# EasyEDA Pro project ProProject_Access Control AC Power Switch_2024-06-06.epro, board V2.0.1 Power Relay PCB
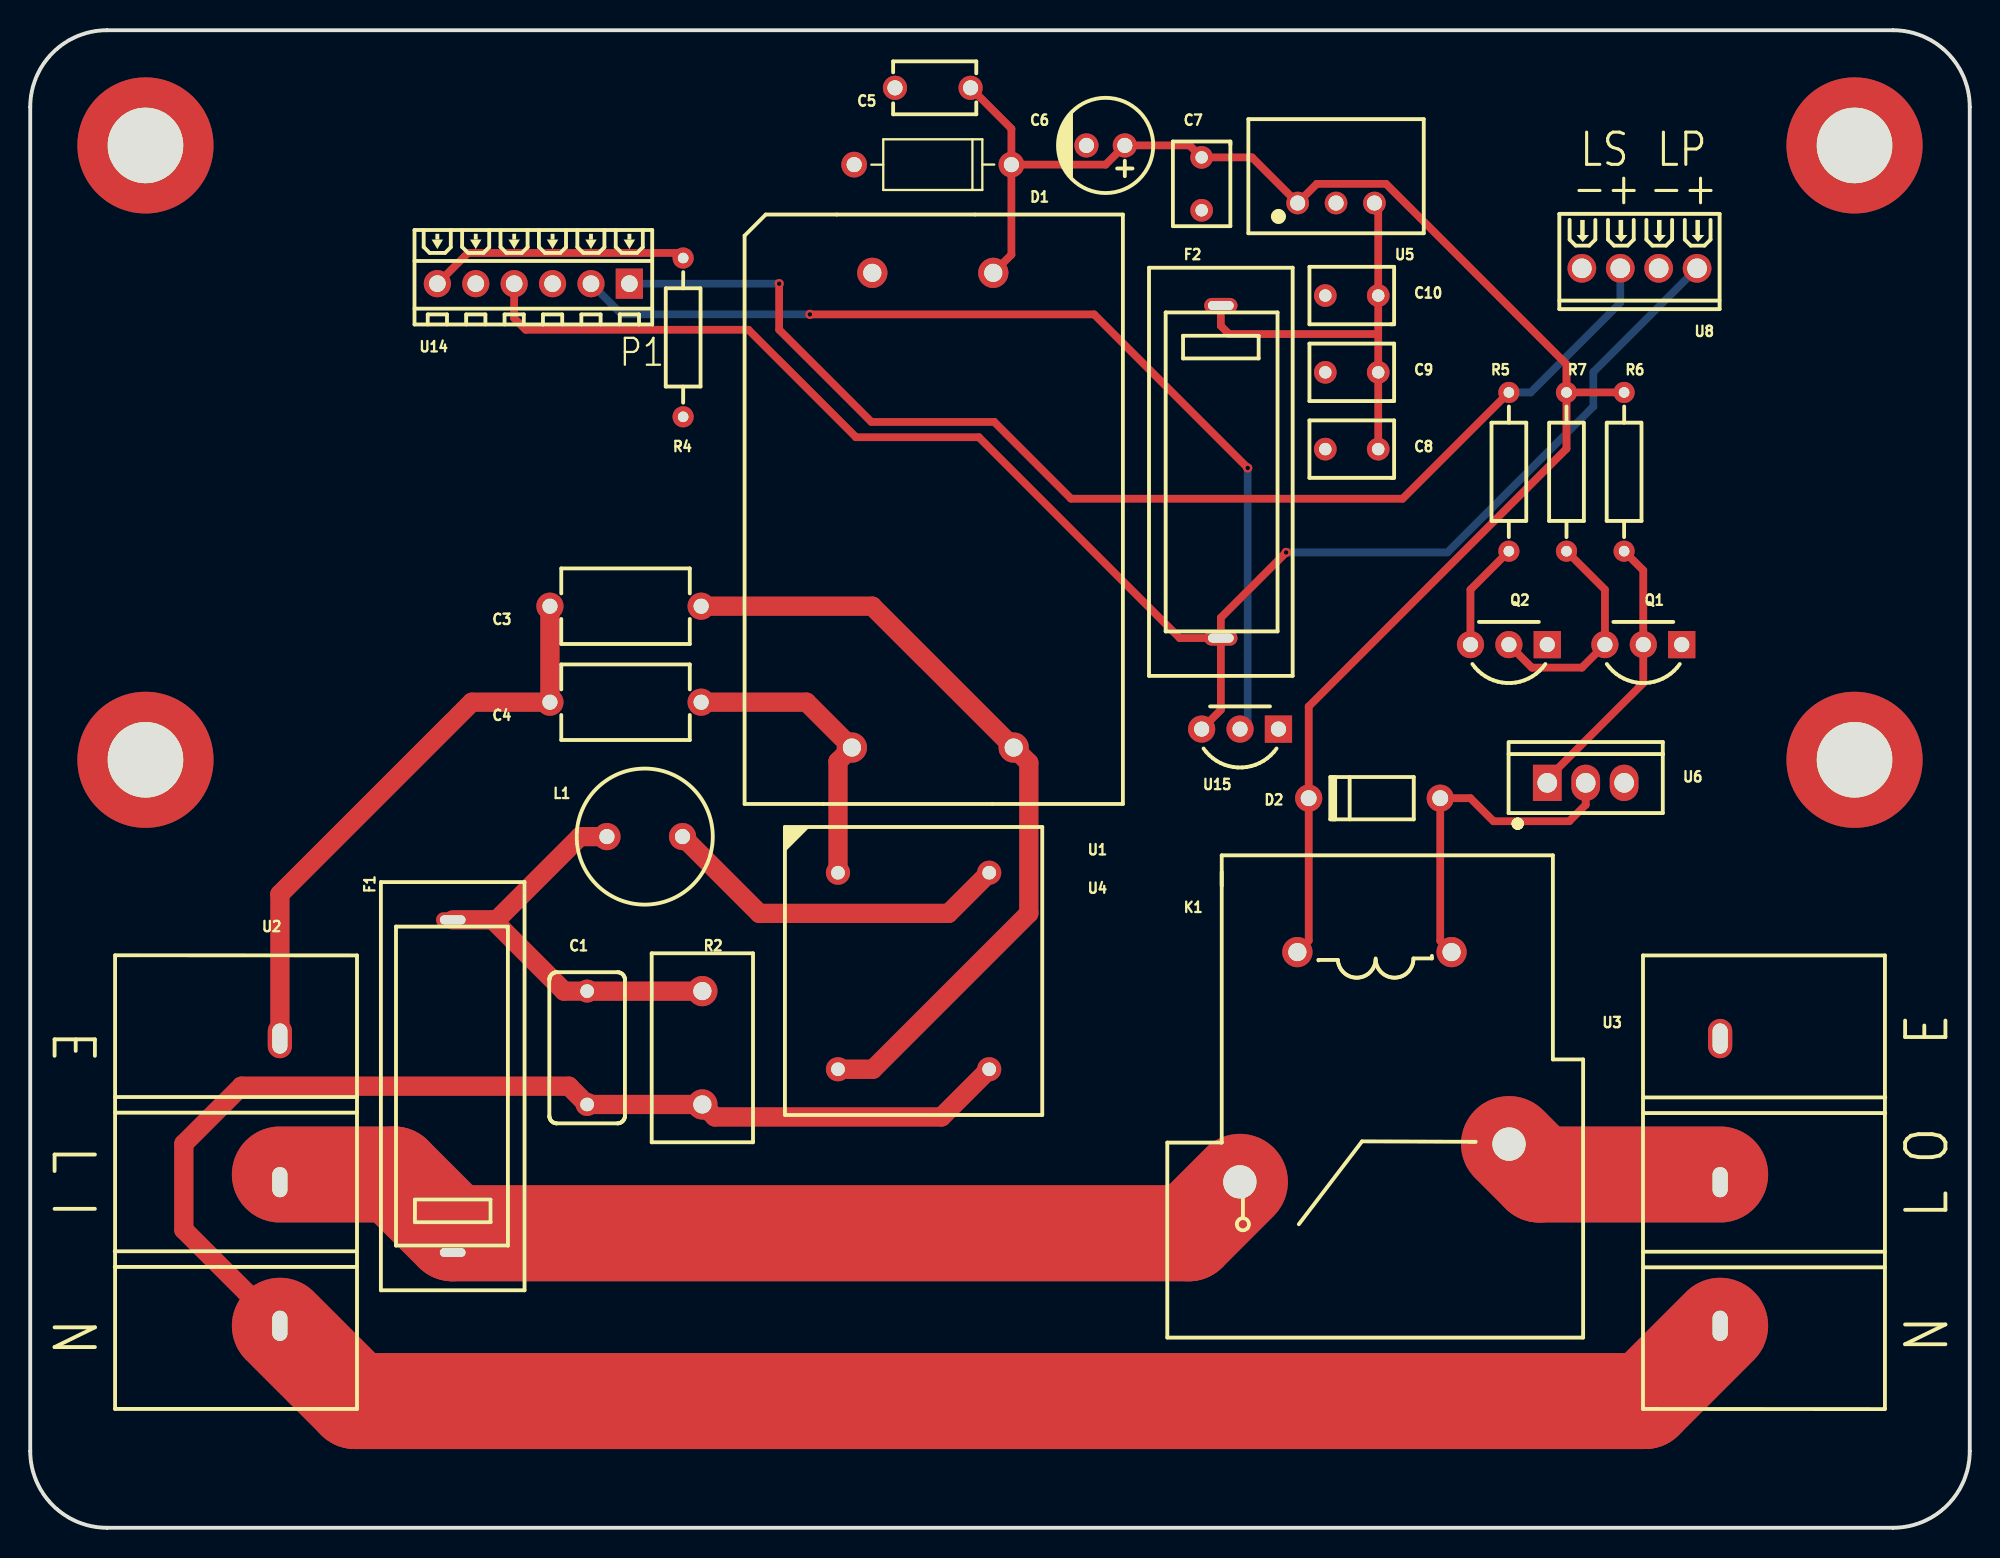
[diagram p7: board, top side]
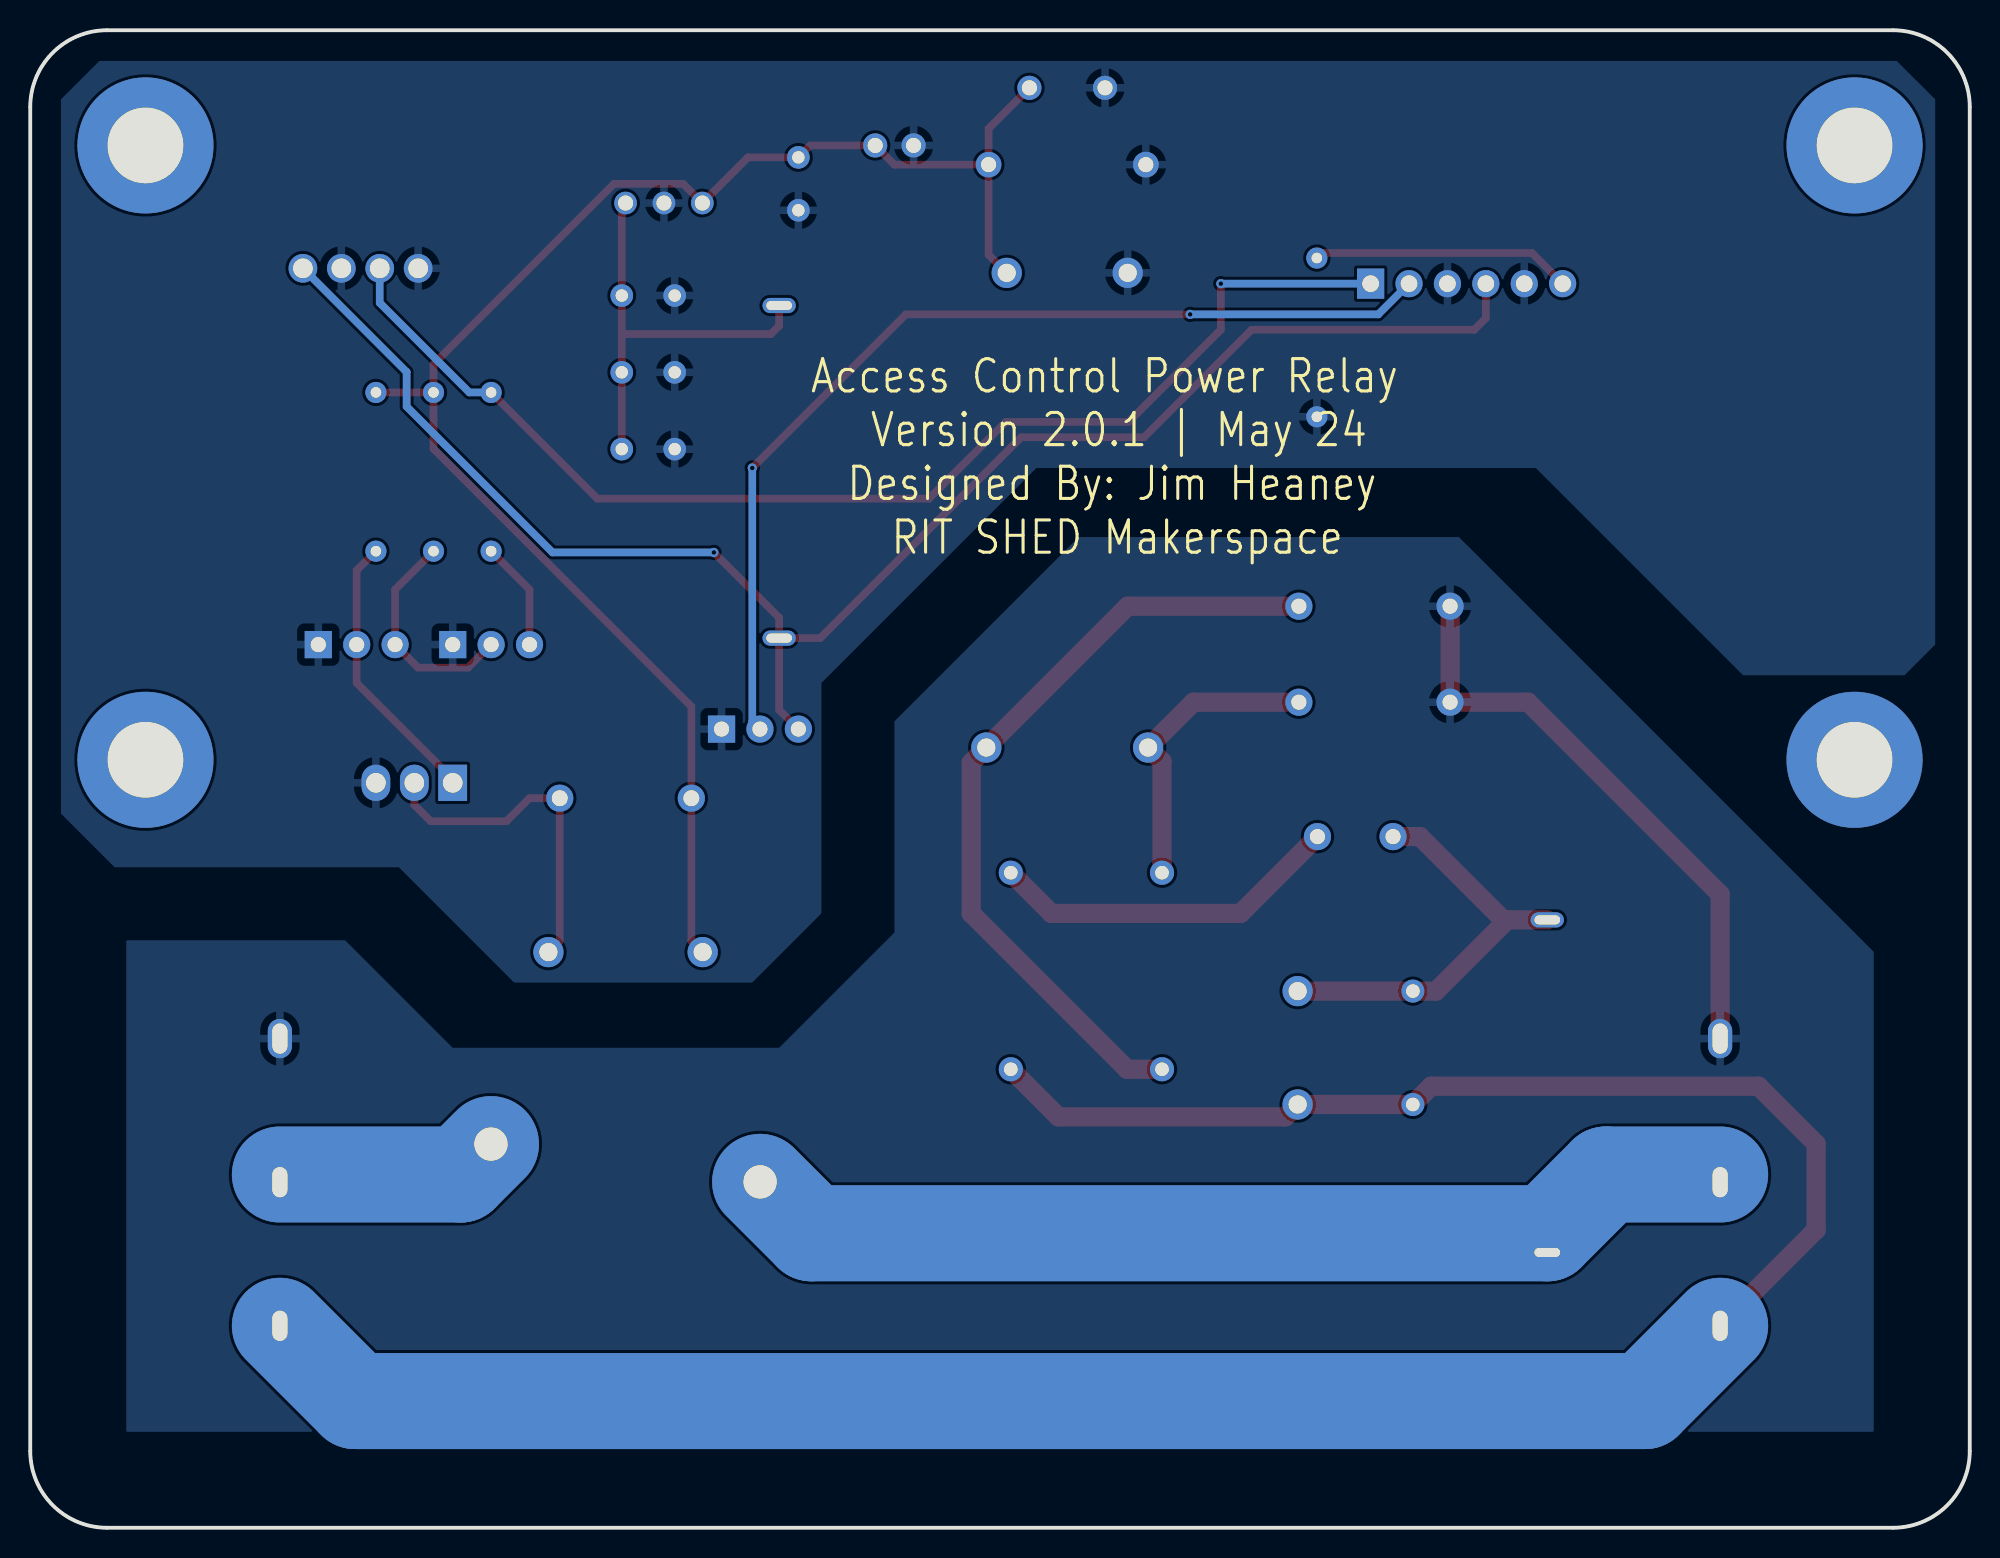
[diagram p8: board, bottom side, seen from below]

Outline 128.27 x 99.06 mm; copper layers: Top Layer, Bottom Layer. Coordinates in mm from the lower left corner of the outline.
Outline path: 0,93.98 0,5.08 arc(1.49,1.49) 5.08,0 123.19,0 arc(126.78,1.49) 128.27,5.08 128.27,93.98 arc(126.78,97.57) 123.19,99.06 5.08,99.06 arc(1.49,97.57) 0,93.98
Stack: Top Layer 0.035mm / Dielectric1 1.51mm FR4 er 4.5 / Bottom Layer 0.035mm

## Design rules (mm)
template: Custom Config
spacing copperThickness1oz (default): track to track 0.102, other pairs 0.152 to 0.3
spacing copperThickness2oz: track to track 0.203, other pairs 0.152 to 0.3
track width copperThickness1oz (default): min 0.127, default 0.254, max 50.8
track width copperThickness2oz: min 0.203, default 0.254, max 2.54
differential pair differentialPair (default): width min 0.127, default 0.254, max 2.54; gap min 0.152, default 0.152
via viaSize (default): diameter min 0.5, default 0.61, max 10; hole min 0.3, default 0.305, max 6.299
pour e695 uses copperRegion1

## Placement (name value [footprint] x y rotation side)
C1  100nF  [CAP-TH_L10.0-W5.0-P7.50-D0.6]  36.83 31.75 270 top
C3  1nF  [CAP-TH_L8.5-W5.0-P10.00-D0.6]  39.37 60.96 0 top
C4  1nF  [CAP-TH_L8.5-W5.0-P10.00-D0.6]  39.37 54.61 180 top
C5  1uF  [CAP-TH_L5.5-W3.5-P5.00-D1.2]  59.69 95.25 0 top
C6  220uF  [CAP-TH_BD6.3-P2.50-D1.0-FD]  71.12 91.44 180 top
C7  10uF  [CAP-TH_L5.5-W3.8-P3.50-D0.6]  77.47 88.9 270 top
C8  10uF  [CAP-TH_L5.5-W3.8-P3.50-D0.6]  87.4 71.35 180 top
C9  10uF  [CAP-TH_L5.5-W3.8-P3.50-D0.6]  87.4 76.43 180 top
C10  10uF  [CAP-TH_L5.5-W3.8-P3.50-D0.6]  87.4 81.51 180 top
D1  P6KE15A  [DO-15_BD3.2-L6.4-P10.40-D0.8-RD]  59.69 90.17 180 top
D2  1N4007  [DO-41_BD2.4-L4.7-P8.70-D0.8-RD]  88.9 48.26 0 top
F1  5x20 BLX-A型 保险丝支架 XC-7  [FUSE-TH_L22.6-W9.0]  27.94 29.21 90 top
F2  5x20 BLX-A型 保险丝支架 XC-7  [FUSE-TH_L22.6-W9.0]  78.74 69.85 270 top
K1  NB90E-12S-S-A  [RELAY-TH_NB90E-XXS-S-A]  88.9 30.48 180 top
L1  560uH  [IND-TH_BD9.0-P5.00-D0.7]  40.64 45.72 0 top
NOREF  -  [Pad_e847]  7.62 50.8 0 top
NOREF#2  -  [Pad_e844]  7.62 91.44 0 top
NOREF#3  -  [Pad_e848]  120.65 50.8 0 top
NOREF#4  -  [Pad_e846]  120.65 91.44 0 top
Q1  2SC1815L-GR-T92-B  [TO-92-3_L4.9-W3.7-P2.54-L]  106.68 58.42 180 top
Q2  2SC1815L-GR-T92-B  [TO-92-3_L4.9-W3.7-P2.54-L]  97.79 58.42 180 top
R2  10D471K  [RES-TH_L12.5-W6.7-P7.50-D1.2]  44.45 31.75 270 top
R4  5.1kΩ  [RES-TH_BD2.3-L6.5-P10.50-D0.5]  43.18 78.74 90 top
R5  5.1kΩ  [RES-TH_BD2.3-L6.5-P10.50-D0.5]  97.79 69.85 270 top
R6  5.1kΩ  [RES-TH_BD2.3-L6.5-P10.50-D0.5]  105.41 69.85 90 top
R7  5.1kΩ  [RES-TH_BD2.3-L6.5-P10.50-D0.5]  101.6 69.85 90 top
U1  TAS10-12-W2  [PWRM-TH_TAS10-XX-W2]  59.69 67.31 90 top
U2  DBT50G-9.5-3P  [CONN-TH_3P-P9.50_DBT50G-9.5-3P]  16.51 22.86 270 top
U3  DBT50G-9.5-3P  [CONN-TH_3P-P9.50_DBT50G-9.5-3P]  111.76 22.86 90 top
U4  YDUU10.5-253L0321  [IND-TH_4P-L19.0-W17.0]  58.42 36.83 270 top
U5  K7805-1000R3  [PWRM-TH_YLPTEC_K78XX-1000R3]  86.36 87.63 0 top
U6  WGP30N10V  [TO-220-3_L10.0-W4.6-P2.54-L]  102.87 49.28 0 top
U8  MX128-2.54-04P-GN01-Cu-Y-A  [CONN-TH_4P-P2.54_MX128-2.54-GN01-04P-CU-Y-A]  106.43 83.31 180 top
U14  MX128-2.54-06P-GN01-Cu-Y-A  [CONN-TH_6P-P2.54_MX128-2.54-6P]  33.27 82.3 180 top
U15  DS18B20+T&R  [TO-92-3_L4.9-W3.7-P2.54-L]  80.01 52.83 180 top

## Footprints (pads in the part's own frame, mm; a bottom-side part is the same pattern mirrored in y, then rotated)
CAP-TH_BD6.3-P2.50-D1.0-FD
  round 1.6 hole 1: 1(-1.27,0) 2(1.27,0)
CAP-TH_L5.5-W3.5-P5.00-D1.2
  round 1.6 hole 1: 1(-2.5,0) 2(2.5,0)
CAP-TH_L5.5-W3.8-P3.50-D0.6
  round 1.5 hole 0.82: 1(-1.75,0) 2(1.75,0)
CAP-TH_L8.5-W5.0-P10.00-D0.6
  round 1.8 hole 1: 1(-5,0) 2(5,0)
CAP-TH_L10.0-W5.0-P7.50-D0.6
  round 1.524 hole 0.9: 1(-3.75,0) 2(3.75,0)
CONN-TH_3P-P9.50_DBT50G-9.5-3P
  oval 2.6x1.6 hole 2x1: 1(-9.5,0) 2(0,0) 3(9.5,0)
CONN-TH_4P-P2.54_MX128-2.54-GN01-04P-CU-Y-A
  round 1.9 hole 1.3: 1(-3.81,0) 2(-1.27,0) 3(1.27,0) 4(3.81,0)
CONN-TH_6P-P2.54_MX128-2.54-6P
  rect 1.8x2 hole 1.1: 1(-6.35,0)
  round 1.8 hole 1.1: 2(-3.81,0) 3(-1.27,0) 4(1.27,0) 5(3.81,0) 6(6.35,0)
DO-15_BD3.2-L6.4-P10.40-D0.8-RD
  round 1.7 hole 1: 1(-5.2,0) 2(5.2,0)
DO-41_BD2.4-L4.7-P8.70-D0.8-RD
  round 1.8 hole 1.05: 1(-4.35,0) 2(4.35,0)
FUSE-TH_L22.6-W9.0
  oval 1x2.2 hole 0.6x1.7: 1(-11,0) 2(11,0)
IND-TH_4P-L19.0-W17.0
  round 1.6 hole 0.9: 1(-6.5,-5) 2(6.5,-5) 3(-6.5,5) 4(6.5,5)
IND-TH_BD9.0-P5.00-D0.7
  round 1.8 hole 1: 1(-2.5,0) 2(2.5,0)
Pad_e844
  round 9 hole 5: 5(0,0)
Pad_e846
  round 9 hole 5: 5(0,0)
Pad_e847
  round 9 hole 5: 5(0,0)
Pad_e848
  round 9 hole 5: 5(0,0)
PWRM-TH_TAS10-XX-W2
  round 2 hole 1.2: 1(-15.7,-5.35) 2(-15.7,5.35) 4(15.7,4) 6(15.7,-4)
PWRM-TH_YLPTEC_K78XX-1000R3
  round 1.5 hole 1: 1(-2.54,0) 2(0,0) 3(2.54,0)
RELAY-TH_NB90E-XXS-S-A
  round 3 hole 2.2: 1(-8.9,5.101) 4(8.9,7.599)
  round 2 hole 1.2: 2(-5.1,-7.599) 3(5.1,-7.599)
RES-TH_BD2.3-L6.5-P10.50-D0.5
  round 1.4 hole 0.7: 1(-5.25,0) 2(5.25,0)
RES-TH_L12.5-W6.7-P7.50-D1.2
  round 2 hole 1.2: 1(-3.749,0) 2(3.749,0)
TO-92-3_L4.9-W3.7-P2.54-L
  rect 1.8x1.8 hole 1: 1(-2.54,0)
  round 1.8 hole 1: 2(0,0) 3(2.54,0)
TO-220-3_L10.0-W4.6-P2.54-L
  rect 1.9x2.4 hole 1.3: 1(-2.54,0)
  oval 1.9x2.4 hole 1.3: 2(0,0) 3(2.54,0)

## Nets
As in the schematic.

Pads without a net: NOREF 5; NOREF#2 5; NOREF#3 5; NOREF#4 5

## Via types
v1: diameter 0.61, hole 0.305, Top Layer to Bottom Layer, 4 vias

## Routing (per net, layer and track width the routed paths; a pad name or vN(x,y) marks a point on that pad's centre or on a via; arc(x,y) is an arc through that point)
EARTH: length 39
  Top Layer w1.27: C3.1 C4.2 29.21,54.61 16.51,41.91 U2.1
LIVE_IN: length 133
  Top Layer w6.35: 16.51,23.37 24.05,23.37 27.94,19.48 76.6,19.48 K1.4
  Bottom Layer w6.35: K1.4 76.6,19.48 27.94,19.48 24.05,23.37 16.51,23.37
LIVE_OUT: length 29.6
  Top Layer w6.35: K1.1 99.81,23.37 111.76,23.37
  Bottom Layer w6.35: 111.76,23.37 99.81,23.37 K1.1
NEUTRAL: length 270.4
  Top Layer w1.27: U4.4 60.27,27.18 45.27,27.18 R2.2 C1.2 35.62,29.21 13.97,29.21 10.16,25.4 10.16,19.71 U2.3
  Top Layer w6.35: U2.3 21.49,8.38 106.78,8.38 U3.1
  Bottom Layer w6.35: U2.3 21.49,8.38 106.78,8.38 U3.1
NO_SIG: length 80.9
  Top Layer w0.508: R5.1 90.76,68.07 68.83,68.07 63.75,73.15 55.63,73.15 49.53,79.25 v1(49.53,82.3)
  Bottom Layer w0.508: R5.1 99.23,75.1 105.16,81.03 U8.3 ; v1(49.53,82.3) U14.1
TEMP: length 66
  Top Layer w0.508: v1(80.52,70.1) 70.36,80.26 v1(51.56,80.26)
  Bottom Layer w0.508: v1(51.56,80.26) 39.12,80.26 U14.2 ; v1(80.52,70.1) 80.52,53.34 U15.2
VRAW: length 108.2
  Top Layer w0.508: C5.2 64.89,92.55 D1.1 ; D1.1 64.89,84.21 U1.6 ; D1.1 71.12,90.17 C6.1 76.68,91.44 C7.1 80.8,90.65 U5.1 85.09,88.9 89.66,88.9 101.6,76.96 R7.2 ; R7.2 R6.2 ; R7.2 101.6,71.37 84.55,54.32 D2.1 84.55,38.83 K1.3
VSW: length 108.1
  Top Layer w0.508: v1(83.06,64.52) 78.74,60.2 F2.2 ; U15.3 78.74,54.1 F2.2 ; U14.4 32,80.01 32.77,79.25 47.5,79.25 54.61,72.14 62.74,72.14 76.02,58.85 F2.2
  Bottom Layer w0.508: U8.1 103.38,76.45 103.38,74.17 93.73,64.52 v1(83.06,64.52)
$1N1267: length 28.3
  Top Layer w1.27: 30.59,40.21 F1.2 ; 30.59,40.21 35.3,35.5 C1.1 R2.1 ; 30.59,40.21 30.85,40.21 36.36,45.72 L1.1
$1N2210: length 28.4
  Top Layer w0.508: F2.1 78.74,79.5 79.28,78.96 89.15,78.96 ; 89.15,78.96 C10.1 89.15,87.38 U5.3 ; 89.15,78.96 C9.1 C8.1
$1N2775: length 22.6
  Top Layer w0.508: U6.2 102.87,47.82 101.78,46.74 96.77,46.74 95.25,48.26 D2.2 93.25,38.83 K1.2
$1N2784: length 18.5
  Top Layer w0.508: R6.1 106.68,63.33 Q1.2 106.68,55.88 100.33,49.53 U6.1
$1N3014: length 14.8
  Top Layer w0.508: Q2.2 99.31,56.9 102.62,56.9 Q1.3 104.14,62.06 R7.1
$1N3022: length 7.2
  Top Layer w0.508: Q2.3 95.25,62.06 R5.2
$1N3091: length 23.5
  Top Layer w1.27: L1.2 48.22,40.64 60.73,40.64 U4.3
$1N3100: length 52.8
  Top Layer w1.27: U4.2 55.73,30.33 66.04,40.64 66.04,50.61 U1.1 55.69,60.96 C3.2
$1N3107: length 19.9
  Top Layer w1.27: U4.1 53.42,50.69 U1.2 51.34,54.61 C4.1
$1N5095: length 17.2
  Top Layer w0.508: U14.6 28.96,84.33 42.84,84.33 R4.2

## Copper pours and planes (outline as drawn; the poured copper is in the pictures)
GND on Bottom Layer: 61.72,70.1 75.95,55.88 75.95,40.64 80.52,36.07 96.27,36.07 103.89,43.69 122.68,43.69 126.24,47.24 126.24,94.49 123.7,97.03 4.83,97.03 2.29,94.49 2.29,58.42 4.32,56.39 14.99,56.39 28.7,70.1
EARTH on Bottom Layer: 6.35,6.35 121.92,6.35 121.92,38.86 107.44,38.86 100.33,31.75 78.74,31.75 71.12,39.37 71.12,53.34 58.93,65.53 33.78,65.53 6.35,38.1

## Text on the board
Bottom Silkscreen Layer: RIT SHED Makerspace | Version 2.0.1 | May 24 | Designed By: Jim Heaney | Access Control Power Relay
Top Silkscreen Layer: P1 | -+ | LS | LP | E | L I | N | L O
